# Altium schematic sheet Dawn.SchDoc: DecaWave DW1000
size A4; CompanyName: SPAN; Engineer: Anh Luong; Organization: University of Utah; Address1: 50 S Central Campus Dr; Address2: MEB Rm 3129; Address3: Salt Lake City, Utah 84115; Address4: USA; Revision: 1; SheetNumber: 2; SheetTotal: 2
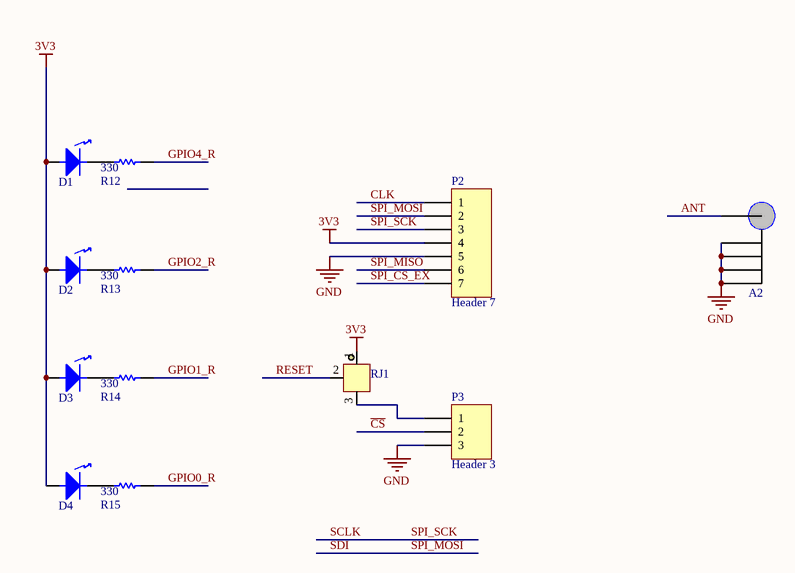
[diagram p0: Dawn.SchDoc]

## Parts
A2  CONSMA003.062  [SMA_EDGE_MNT]  (value not drawn)
D1  LG Q971-KN-1  [CHIPLED0603]  (value not drawn)
D2  LG Q971-KN-1  [CHIPLED0603]  (value not drawn)
D3  LG Q971-KN-1  [CHIPLED0603]  (value not drawn)
D4  LG Q971-KN-1  [CHIPLED0603]  (value not drawn)
P2  Header 7  [HDR1X7]
P3  Header 3  [HDR1X3]
R12  MCR03ERTJ331  [RESC1608X06N (0603)]  (value not drawn)
R13  MCR03ERTJ331  [RESC1608X06N (0603)]  (value not drawn)
R14  MCR03ERTJ331  [RESC1608X06N (0603)]  (value not drawn)
R15  MCR03ERTJ331  [RESC1608X06N (0603)]  (value not drawn)
RJ1  R_J  [RJ]  (value not drawn)

## Nets
3V3: D1.1 D2.1 D3.1 D4.1 P2.4 RJ1.1
GND: A2.2 A2.3 A2.4 A2.5 P2.5 P3.3
ANT: A2.1
~{CS}: P3.2
CLK: P2.1
GPIO0_R: R15.2
GPIO1_R: R14.2
GPIO2_R: R13.2
GPIO4_R: R12.2
RESET: RJ1.2
SCLK: P2.3  [also labelled SPI_SCK]
SDI: P2.2  [also labelled SPI_MOSI]
SPI_CS_EX: P2.7
SPI_MISO: P2.6
NetD1_2: D1.2 R12.1
NetD2_2: D2.2 R13.1
NetD3_2: D3.2 R14.1
NetD4_2: D4.2 R15.1
NetP3_1: P3.1 RJ1.3

## Notes on the sheet
- Title
- Designed by:
- Date:
- Time:
- Revision:
- Sheet
- of
- File:

## Library data of the parts
A2 = CONSMA003.062: CONN SMA JACK 50 OHM EDGE MNT; Manufacturer: Linx Technologies Inc; Connector Type: Jack, Female Socket; Contact Termination: Solder; Impedance: 50 Ohm; Body Material: Brass; Body Finish: Nickel; Center Contact Material: Beryllium Copper; Center Contact Plating: Gold; Dielectric Material: Polytetrafluoroethylene (PTFE); Supplier 1: Digi-Key; Manufacturer Part Number: CONSMA003.062; RoHS: RoHS Compliant; Category: Connectors, Interconnects; Stock 1: 6857; Pricing 1: 1=3.37, 25=3.09, 100=2.81, 500=2.6125 (USD); Packaging: Bulk; Connector Style: SMA; Shield Termination: Solder; Mounting Type: Board Edge, End Launch; Cable Group: -; Fastening Type: Threaded; Frequency - Max: -; Features: -; Housing Color: Silver; Ingress Protection: -; Voltage Rating: -; Operating Temperature: -65°C ~ 165°C; ComponentLink1URL: http://www.linxtechnologies.com/resources/diagrams/consma003.062.pdf; ComponentLink1Description: http://www.linxtechnologies.com/resources/diagrams/consma003.062.pdf
D1-D4 = LG Q971-KN-1: LED CHIPLED 570NM GREEN 0603 SMD; Manufacturer: OSRAM Opto Semiconductors Inc; Wavelength - Peak: 572nm; Millicandela Rating: 10mcd; Voltage - Forward (Vf) Typ: 2.2V; Current - Test: 20mA; Viewing Angle: 160°; Lens Type: Diffused; Lens Style/Size: Rectangle with Flat Top, 1mm x 0.8mm; Supplier 1: Digi-Key; Manufacturer Part Number: LG Q971-KN-1; RoHS: RoHS Compliant; Category: Optoelectronics; Stock 1: 44000; Pricing 1: 4000=0.03632 (USD); Packaging: Tape & Reel (TR); Color: Green; Wavelength - Dominant: 570nm; Package / Case: 0603 (1608 Metric); Size / Dimension: 1.60mm L x 0.80mm W; Height: 0.80mm; Mounting Type: Surface Mount; Luminous Flux @ Current - Test: -; ComponentLink1URL: http://catalog.osram-os.com/catalogue/catalogue.do;jsessionid=DE4D071D0D2758CC117C711BF848053E?act=downloadFile&favOid=0200000600005069000100b6; ComponentLink1Description: http://catalog.osram-os.com/catalogue/catalogue.do;jsessionid=DE4D071D0D2758CC117C711BF848053E?act=downloadFile&favOid=0200000600005069000100b6
P2 = Header 7: Header, 7-Pin; LatestRevisionDate: 17-Jul-2002; LatestRevisionNote: Re-released for DXP Platform.; Publisher: Altium Limited
P3 = Header 3: Header, 3-Pin; LatestRevisionDate: 17-Jul-2002; LatestRevisionNote: Re-released for DXP Platform.; Publisher: Altium Limited
R12-R15 = MCR03ERTJ331: RES 330 OHM 1/10W 5% 0603 SMD; Manufacturer: Rohm Semiconductor; Resistance (Ohms): 330; Power (Watts): 0.1W, 1/10W; Temperature Coefficient: ±200ppm/°C; Supplier 1: Digi-Key; Manufacturer Part Number: MCR03ERTJ331; RoHS: RoHS Compliant; Category: Resistors; Stock 1: 12878; Pricing 1: 1=0.1, 10=0.013, 25=0.0092, 100=0.0052, 250=0.00396, 500=0.00316, 1000=0.00233 (USD); Packaging: Digi-Reel®; Tolerance: ±5%; Composition: Thick Film; Features: -; Package / Case: 0603 (1608 Metric); Supplier Device Package: 0603 (1608 Metric); Size / Dimension: 0.063" L x 0.031" W (1.60mm x 0.80mm); Height: 0.022" (0.55mm); Number of Terminations: 2; ComponentLink1URL: http://rohmfs.rohm.com/en/products/databook/datasheet/passive/resistor/chip_resistor/mcr_g.pdf; ComponentLink1Description: http://rohmfs.rohm.com/en/products/databook/datasheet/passive/resistor/chip_resistor/mcr_g.pdf
RJ1 = R_J: Resistor Jumper; Value: DNP; Mounting Type: Surface Mount, MLCC; Applications: General Purpose; Package / Case: 0603 (1608 Metric)